# EAGLE design LED Strip Adapter (EAGLE 7.7.0)
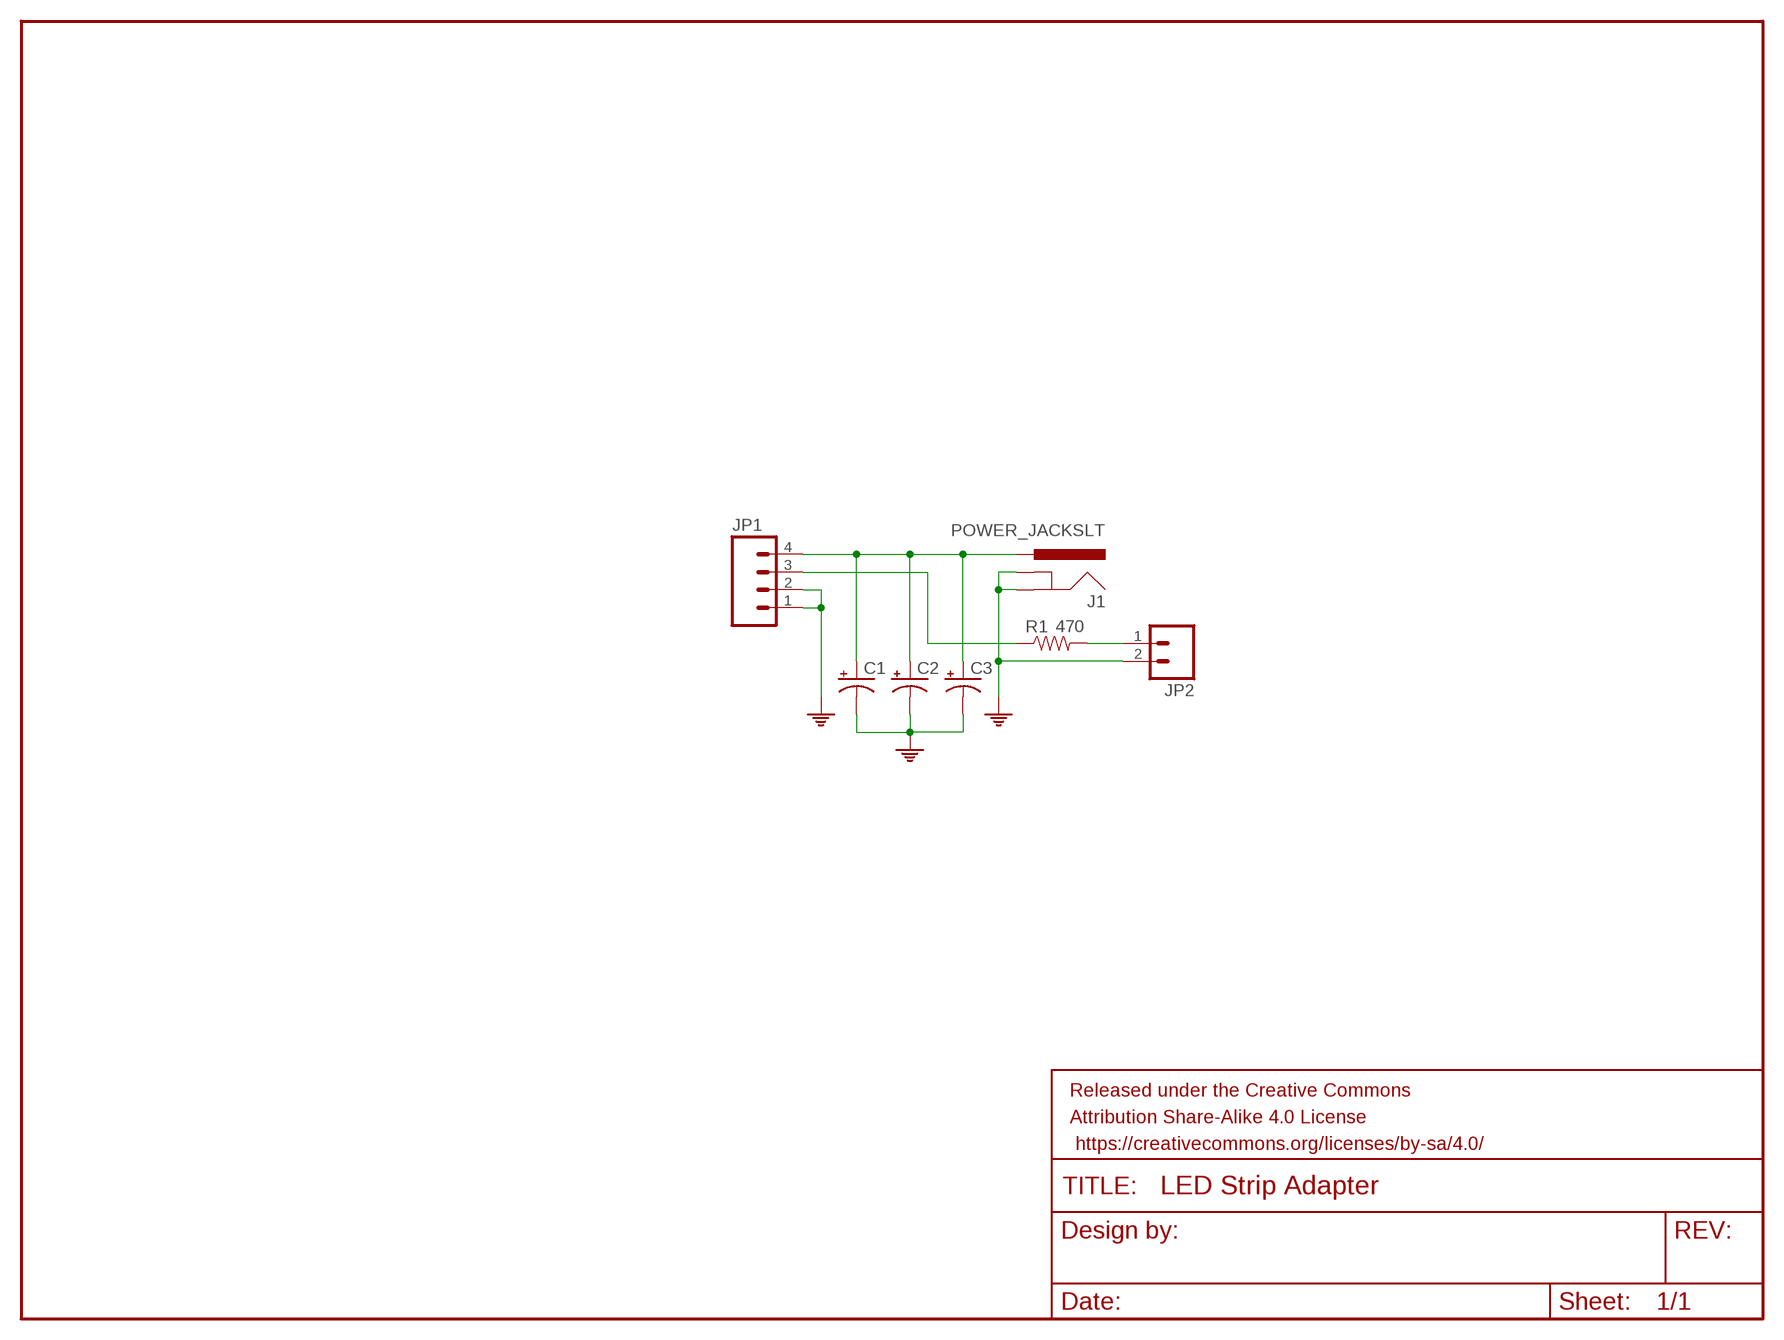
[diagram p0: schematic, sheet 1]

## Parts
C1  CAP_POLPTH2  [CPOL-RADIAL-10UF-25V]
C2  CAP_POLPTH2  [CPOL-RADIAL-10UF-25V]
C3  CAP_POLPTH2  [CPOL-RADIAL-10UF-25V]
FRAME1  FRAME-LETTER  [CREATIVE_COMMONS]
J1  POWER_JACKSLT  [POWER_JACK_SLOT]
JP1  M04LOCK_LONGPADS  [1X04_LOCK_LONGPADS]
JP2  M02LOCK_LONGPADS  [1X02_LOCK_LONGPADS]
R1  470  RESISTOR1206  [1206]

## Nets
GND: C1.2(-) C2.2(-) C3.2(-) J1.GND@1(GNDBREAK) J1.GND@2(GND) JP1.1 JP1.2 JP2.2 ; supply symbol labelled GND_US
N$1: JP2.1 R1.2
PWR: C1.1(+) C2.1(+) C3.1(+) J1.PWR JP1.4
SIG: JP1.3 R1.1

## Library data of the parts
C1-C3 = 1-Generic:CAP_POL: Capacitor Polarized These are standard SMD and PTH capacitors. Normally 10uF, 47uF, and 100uF in electrolytic and tantalum varieties. Always verify the external diameter of the through hole cap, it varies with capacity, voltage, and manufacturer. The EIA devices should be standard.
FRAME1 = 1-Generic:FRAME-LETTER: Schematic Frame Standard 8.5x11 US Letter frame
J1 = SparkFun:POWER_JACK: Power Jack This is the standard 5.5mm barrel jack for power. The PTH is the most common, proven, reliable, footprint. All others are experimental. The Slot footprint only works if the mill layer is transmitted to the PCB fab house so be warned. Spark Fun Electronics SKU : PRT-00119. Mating wall wart : TOL-00298 (and others)
JP1 = 1-Generic:M04: Header 4 Standard 4-pin 0.1" header. Use with straight break away headers (SKU : PRT-00116), right angle break away headers (PRT-00553), swiss pins (PRT-00743), machine pins (PRT-00117), and female headers (PRT-00115). Molex polarized connector foot print use with SKU : PRT-08231 with associated crimp pins and housings.
JP2 = 1-Generic:M02: Header 2 Standard 2-pin 0.1" header. Use with straight break away headers (SKU : PRT-00116), right angle break away headers (PRT-00553), swiss pins (PRT-00743), machine pins (PRT-00117), and female headers (PRT-00115). Molex polarized connector foot print use with SKU : PRT-08233 with associated crimp pins and housings.
R1 = 1-Generic:RESISTOR: Resistor Basic schematic elements and footprints for 0603, 1206, and PTH 1/10th watt (small) resistors.

## Board
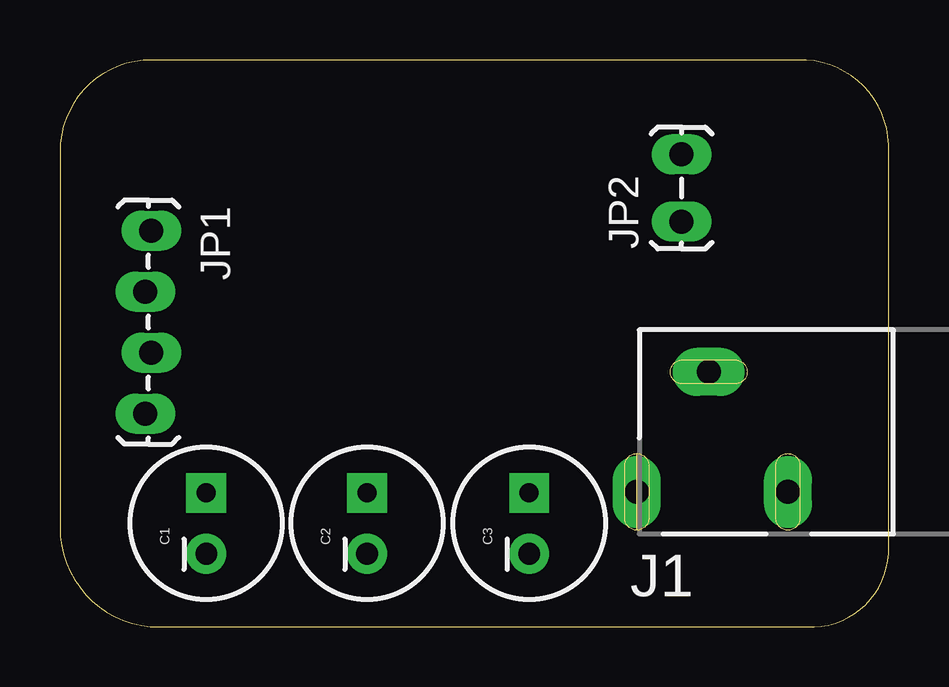
[diagram p1: board, top side]
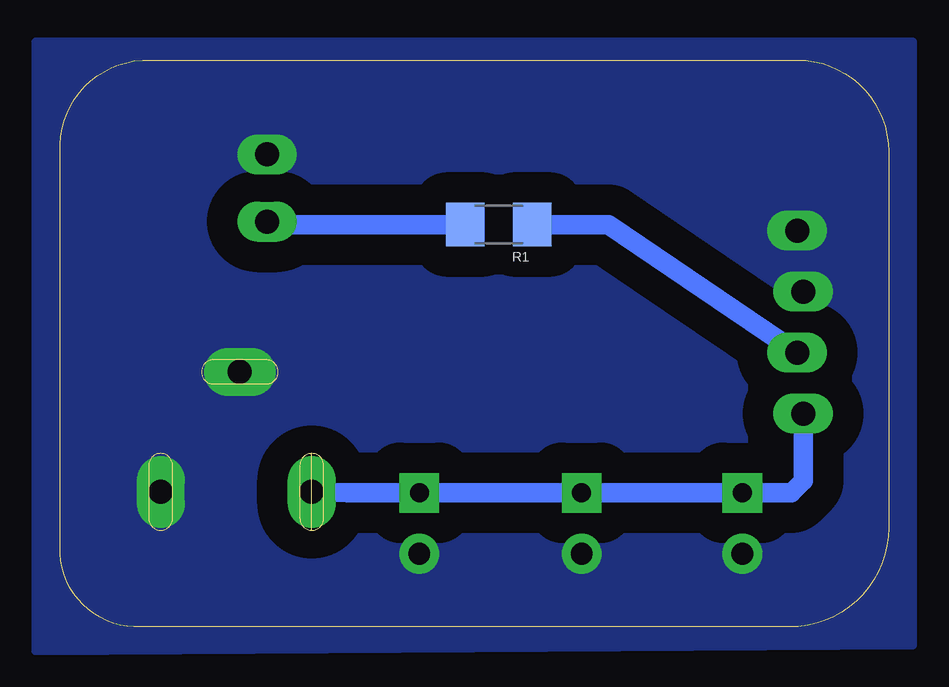
[diagram p2: board, bottom side, seen from below]

Size 34.54 x 23.62 mm. Coordinates in mm from the lower left corner, seen from the top.
Outline: 0,19.81 0,4.13 arc90 4.14,0 31.44,0 arc90 34.54,3.35 34.54,20.1 arc90 30.77,23.62 3.81,23.62 arc90 0,19.81
Copper layers (1*16): Top 0.035mm / dielectric 1.5mm / Bottom 0.035mm
Design rules "OthermillDRC_1_32_v2 *": minimum track width 8mil, minimum drill 0.8mm, track to track 0.794003125mm, track to pad 0.794003125mm, pad to pad 0.794003125mm, via to via 0.794003125mm, smd to smd 0mil, copper to edge 0mil, drill to drill 1mil, minimum pad ring 13mil, minimum via ring 10mil, stop-mask expansion 1mil, vias tented up to drill 30mil, thermal gap 10mil

### Footprints (pad centres in the part's own frame; a part is rotated, then mirrored left to right if it is on the bottom)
CPOL-RADIAL-10UF-25V = drill 0.8 pad 1.651 square: 1 1.27,0 | drill 0.9 pad 1.651: 2 -1.27,0
POWER_JACK_SLOT = drill 1 pad 2 long: GND@1 2.58,7.5; GND@2 7.58,10.8; PWR 2.58,13.8
1X04_LOCK_LONGPADS = drill 1 long: 1 0,0; 2 2.54,-0.254; 3 5.08,0; 4 7.62,-0.254
1X02_LOCK_LONGPADS = drill 1 long: 1 -0.127,0; 2 2.667,0
1206 = smd 1.6 x 1.8: 1 -1.4,0; 2 1.4,0

### Placement (x,y rotation side)
C1  6.1,4.32 90 top
C2  12.8,4.32 90 top
C3  19.56,4.32 90 top
FRAME1  8.13,-23.37 0 top  (outside the outline)
J1  37.85,3.05 90 top
JP1  3.81,16.51 270 top
JP2  25.91,17.02 90 top
R1  16.26,16.76 180 bottom

### Tracks (layer width: path | path; a pad name or v marks a point on that pad's centre or on a via)
GND
  pour Bottom (isolate 1.27, no thermals): -1.02,24.38 35.56,24.38 35.56,-1.02 -1.02,-0.76
N$1
  Bottom 0.813: R1.2 25.91,16.76 JP2.1
PWR
  Bottom 0.813: JP1.4 3.56,6.1 4.06,5.59 C1.1 C2.1 C3.1 22.56,5.59 J1.PWR
SIG
  Bottom 0.813: JP1.3 11.68,16.76 R1.1